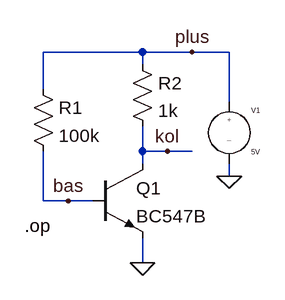
[diagram p0: schematic Q1.asc]
Q1.asc, the LTspice schematic file:
Version 4
SHEET 1 880 680
WIRE 224 -16 96 -16
WIRE 288 -16 224 -16
WIRE 336 -16 288 -16
WIRE 224 0 224 -16
WIRE 96 32 96 -16
WIRE 336 48 336 -16
WIRE 224 112 224 80
WIRE 256 112 224 112
WIRE 288 112 256 112
WIRE 224 128 224 112
WIRE 336 144 336 128
WIRE 96 176 96 112
WIRE 128 176 96 176
WIRE 160 176 128 176
WIRE 224 256 224 224
FLAG 224 256 0
FLAG 336 144 0
FLAG 288 -16 plus
FLAG 256 112 kol
FLAG 128 176 bas
SYMBOL EIT_Semiconductors\\npn 160 128 R0
SYMATTR InstName Q1
SYMATTR Value BC547B
SYMBOL res 80 16 R0
SYMATTR InstName R1
SYMATTR Value 100k
SYMBOL res 208 -16 R0
SYMATTR InstName R2
SYMATTR Value 1k
SYMBOL source-V 336 32 R0
SYMATTR InstName V1
SYMATTR Value 5V
TEXT 72 208 Left 2 !.op

The netlist it stands for:
* Q1.asc
Q1 kol bas 0 0 BC547B
R1 plus bas 100k
R2 plus kol 1k
V1 plus 0 5V
.model NPN NPN
.model PNP PNP
.lib standard.bjt
.op
.backanno
.end